# EAGLE schematic stereo_mix_back (EAGLE 9.4.2)

## Sheet 1 of 3: Channels
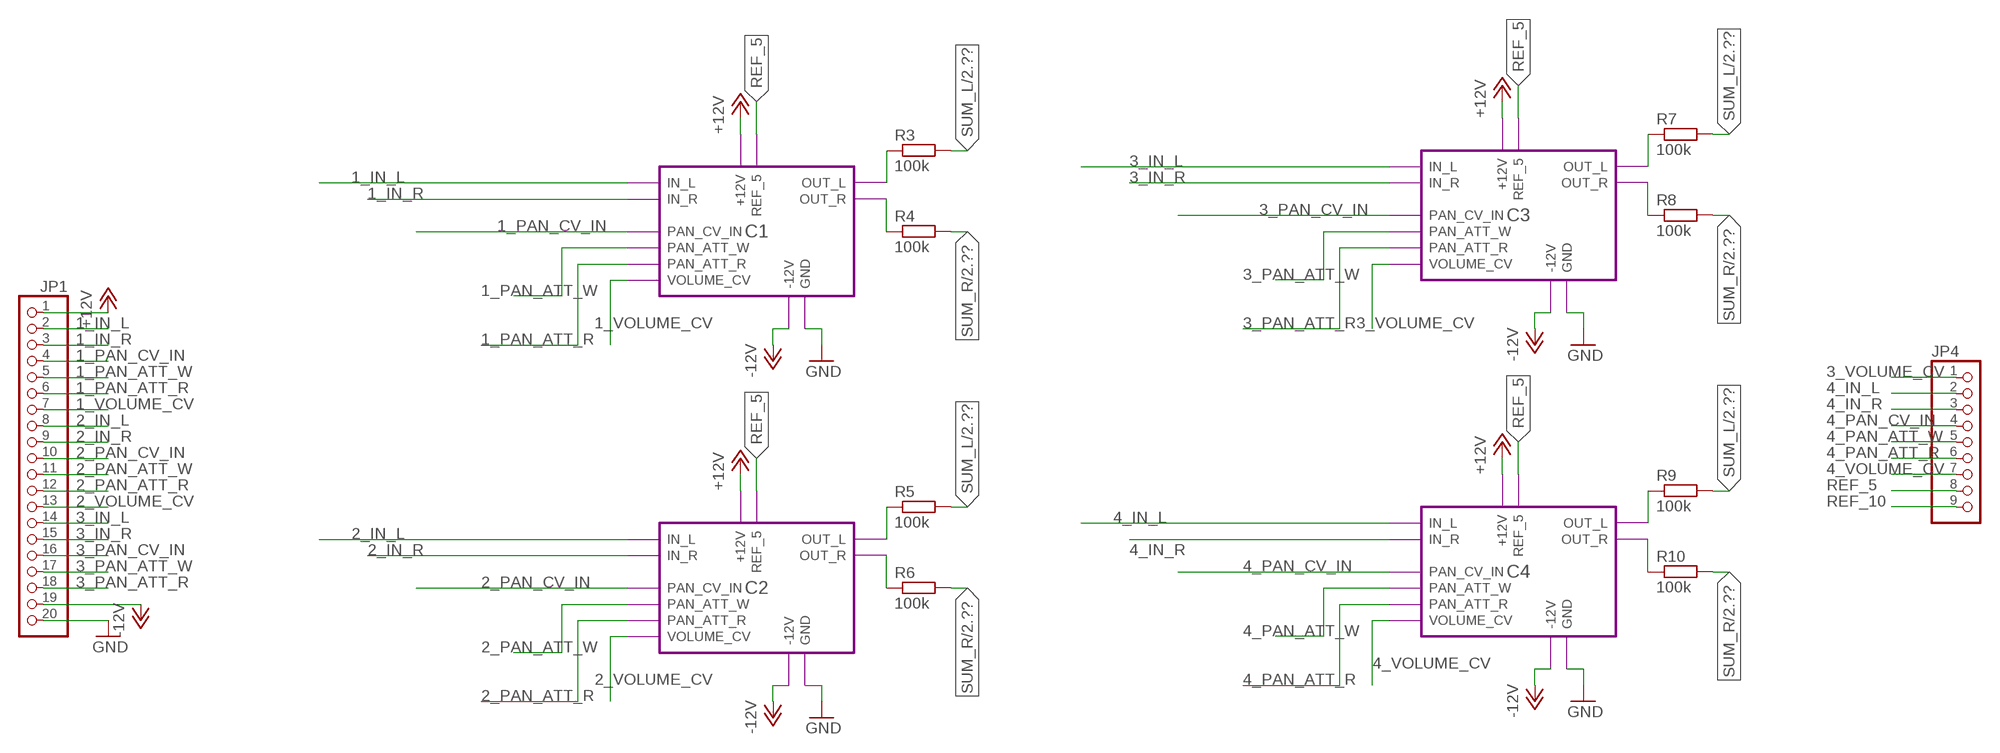
[diagram p0: schematic, sheet 1]

### Parts
JP1  PINHD-1X20  [1X20]
JP4  PINHD-1X9  [1X09]
R3  100k  R-EU_R0603  [R0603]
R4  100k  R-EU_R0603  [R0603]
R5  100k  R-EU_R0603  [R0603]
R6  100k  R-EU_R0603  [R0603]
R7  100k  R-EU_R0603  [R0603]
R8  100k  R-EU_R0603  [R0603]
R9  100k  R-EU_R0603  [R0603]
R10  100k  R-EU_R0603  [R0603]

### Module instances
C2 = CHANNEL
C3 = CHANNEL
C4 = CHANNEL
C1 = CHANNEL

### Nets
1_IN_L: JP1.2 ; port C1.IN_L
1_IN_R: JP1.3 ; port C1.IN_R
1_PAN_ATT_R: JP1.6 ; port C1.PAN_ATT_R
1_PAN_ATT_W: JP1.5 ; port C1.PAN_ATT_W
1_PAN_CV_IN: JP1.4 ; port C1.PAN_CV_IN
1_VOLUME_CV: JP1.7 ; port C1.VOLUME_CV
2_IN_L: JP1.8 ; port C2.IN_L
2_IN_R: JP1.9 ; port C2.IN_R
2_PAN_ATT_R: JP1.12 ; port C2.PAN_ATT_R
2_PAN_ATT_W: JP1.11 ; port C2.PAN_ATT_W
2_PAN_CV_IN: JP1.10 ; port C2.PAN_CV_IN
2_VOLUME_CV: JP1.13 ; port C2.VOLUME_CV
3_IN_L: JP1.14 ; port C3.IN_L
3_IN_R: JP1.15 ; port C3.IN_R
3_PAN_ATT_R: JP1.18 ; port C3.PAN_ATT_R
3_PAN_ATT_W: JP1.17 ; port C3.PAN_ATT_W
3_PAN_CV_IN: JP1.16 ; port C3.PAN_CV_IN
3_VOLUME_CV: JP4.1 ; port C3.VOLUME_CV
4_IN_L: JP4.2 ; port C4.IN_L
4_IN_R: JP4.3 ; port C4.IN_R
4_PAN_ATT_R: JP4.6 ; port C4.PAN_ATT_R
4_PAN_ATT_W: JP4.5 ; port C4.PAN_ATT_W
4_PAN_CV_IN: JP4.4 ; port C4.PAN_CV_IN
4_VOLUME_CV: JP4.7 ; port C4.VOLUME_CV
+12V: JP1.1 ; port C2.+12V C3.+12V C4.+12V C1.+12V ; also sheet 2,3
-12V: JP1.19 ; port C2.-12V C3.-12V C4.-12V C1.-12V ; also sheet 2,3
GND: JP1.20 ; port C2.GND C3.GND C4.GND C1.GND ; also sheet 2,3
N$29: R3.1 ; port C1.OUT_L
N$30: R4.1 ; port C1.OUT_R
N$33: R5.1 ; port C2.OUT_L
N$35: R6.1 ; port C2.OUT_R
N$37: R7.1 ; port C3.OUT_L
N$38: R8.1 ; port C3.OUT_R
N$39: R9.1 ; port C4.OUT_L
N$40: R10.1 ; port C4.OUT_R
REF_5: JP4.8 ; also sheet 3
REF_10: JP4.9 ; also sheet 3
SUM_L: R3.2 R5.2 R7.2 R9.2 ; also sheet 2
SUM_R: R4.2 R6.2 R8.2 R10.2 ; also sheet 2

## Sheet 2 of 3: Output
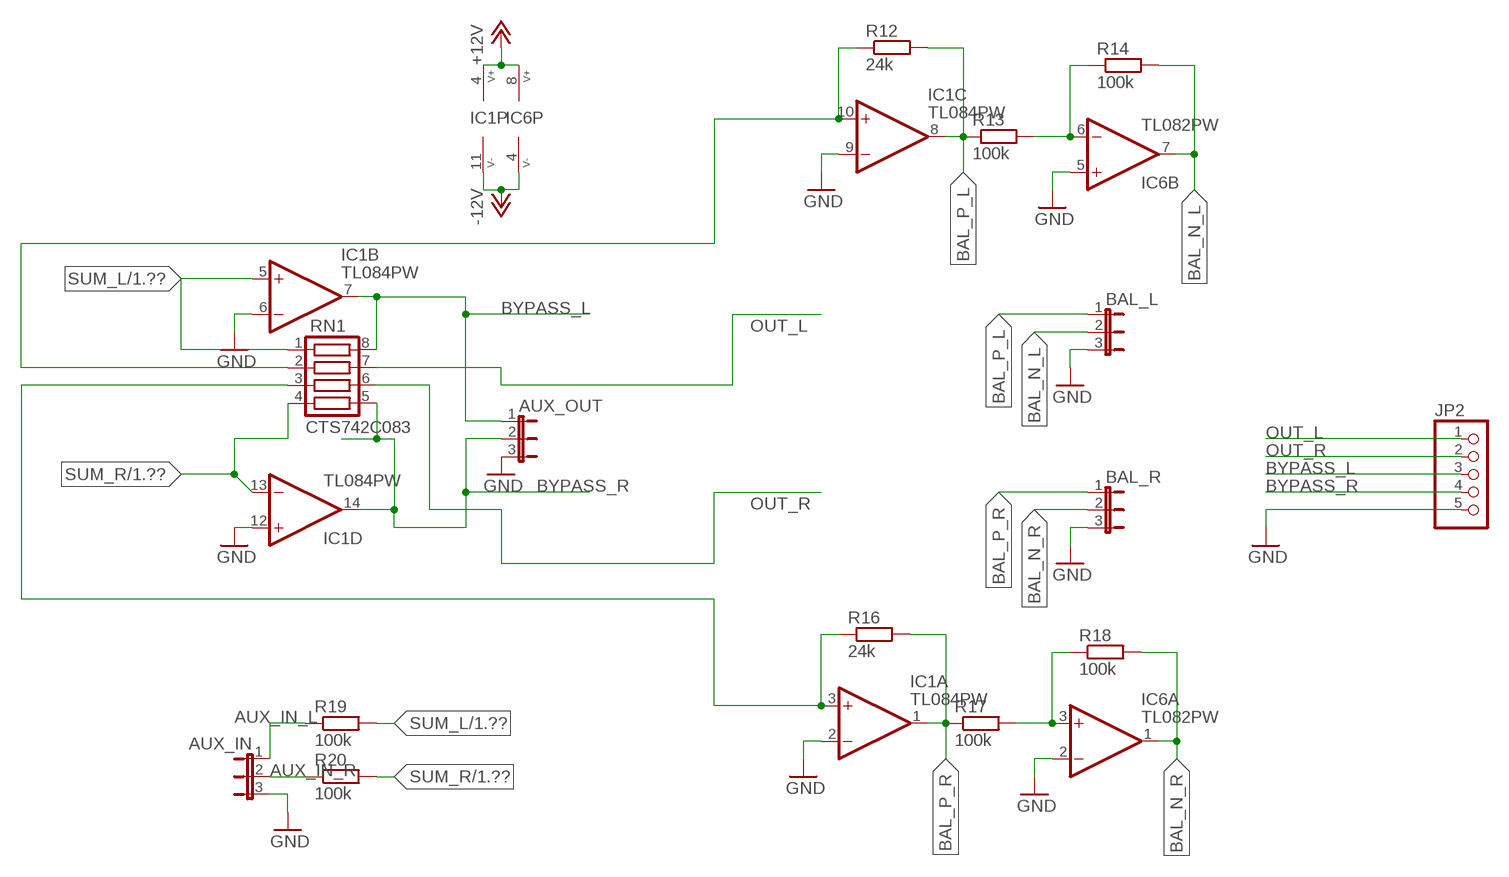
[diagram p1: schematic, sheet 2]

### Parts
AUX_IN  JP2E  [JP2]
AUX_OUT  JP2E  [JP2]
BAL_L  JP2E  [JP2]
BAL_R  JP2E  [JP2]
IC1  TL084PW  [TSSOP14]
IC6  TL082PW  [TSSOP8]
JP2  PINHD-1X5  [1X05]
R12  24k  R-EU_R0603  [R0603]
R13  100k  R-EU_R0603  [R0603]
R14  100k  R-EU_R0603  [R0603]
R16  24k  R-EU_R0603  [R0603]
R17  100k  R-EU_R0603  [R0603]
R18  100k  R-EU_R0603  [R0603]
R19  100k  R-EU_R0603  [R0603]
R20  100k  R-EU_R0603  [R0603]
RN1  CTS742C083  [CTS742C083]

### Nets
+12V: IC1.4(P:V+) IC6.8(P:V+) ; also sheet 1,3
-12V: IC1.11(P:V-) IC6.4(P:V-) ; also sheet 1,3
AUX_IN_L: AUX_IN.1 R19.1
AUX_IN_R: AUX_IN.2 R20.1
BAL_N_L: BAL_L.2 IC6.7(B:OUT) R14.2
BAL_N_R: BAL_R.2 IC6.1(A:OUT) R18.2
BAL_P_L: BAL_L.1 IC1.8(C:OUT) R12.2 R13.1
BAL_P_R: BAL_R.1 IC1.1(A:OUT) R16.2 R17.1
BYPASS_L: AUX_OUT.1 IC1.7(B:OUT) JP2.3 RN1.8
BYPASS_R: AUX_OUT.2 IC1.14(D:OUT) JP2.4 RN1.5
GND: AUX_IN.3 AUX_OUT.3 BAL_L.3 BAL_R.3 IC1.2(A:-IN) IC1.6(B:-IN) IC1.9(C:-IN) IC1.12(D:+IN) IC6.2(A:-IN) IC6.5(B:+IN) JP2.5 ; also sheet 1,3
N$32: IC1.10(C:+IN) R12.1 RN1.2
N$42: IC1.3(A:+IN) R16.1 RN1.3
N$43: IC6.3(A:+IN) R17.2 R18.1
N$45: IC6.6(B:-IN) R13.2 R14.1
OUT_L: JP2.1 RN1.7
OUT_R: JP2.2 RN1.6
SUM_L: IC1.5(B:+IN) R19.2 RN1.1 ; also sheet 1
SUM_R: IC1.13(D:-IN) R20.2 RN1.4 ; also sheet 1

## Sheet 3 of 3: Power
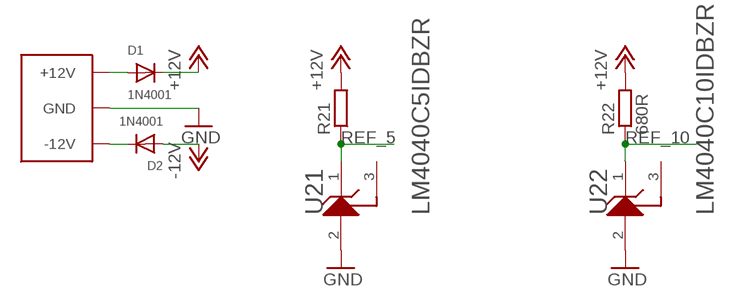
[diagram p2: schematic, sheet 3]

### Parts
C5  EURO_POWER_LOCKFAT-LOCK  [EURO_PWR_HEADER_LOCK]
D1  1N4001  DIODESMA  [SMADIODE]
D2  1N4001  DIODESMA  [SMADIODE]
R21  R-EU_R0603  [R0603]
R22  680R  R-EU_R0603  [R0603]
U21  TEXAS_INSTRUMENTS_LM4040C5IDBZR  [TEXAS_INSTRUMENTS_LM4040C5IDBZR_0]
U22  TEXAS_INSTRUMENTS_LM4040C10IDBZR  [TEXAS_INSTRUMENTS_LM4040C5IDBZR_0]

### Nets
+12V: D1.C R21.2 R22.2 ; also sheet 1,2
-12V: D2.A ; also sheet 1,2
GND: C5.GND1(GND) C5.GND2(GND) C5.GND3(GND) C5.GND4(GND) C5.GND5(GND) C5.GND6(GND) U21.2(ANODE) U22.2(ANODE) ; also sheet 1,2
N$47: C5.POS1(+12V) C5.POS2(+12V) D1.A
N$48: C5.NEG1(-12V) C5.NEG2(-12V) D2.C
REF_5: R21.1 U21.1(CATHODE) ; also sheet 1
REF_10: R22.1 U22.1(CATHODE) ; also sheet 1
Unconnected: U21.3(NC) U22.3(NC)

## Library data of the parts
AUX_IN AUX_OUT BAL_L BAL_R = jumper:JP2E: JUMPER
C5 = MusicThingModular:EURO_POWER_LOCK
D1 D2 = adafruit:DIODE: Diode SMADIODE - SMA Surface Mount Package 20V 1A Schottky Diode Digikey: 641-1014-6-ND DO-1N4148 - Through Hole Small Current Diode SOD-123 20V 1 A (.5mV Vf) Schottky Diode - Digikey: MBRX120TPMSCT-ND SOD-323 10V 570mA (.38mV Vf, 3ns) Schottky Diode - Digikey: ZLLS410CT-ND SOD-523 30V 30mA Schottky Diode (RB751S-40TE61) - Digikey: RB751S-40TE61CT-ND SOT23-R/W - SOT23 Package (R = Solder Paste/Reflow Ovens, W = Hand-Soldering) BAT54Film 40V 300mA - Digikey: 497-7162-1-ND
IC1 = op-amp:TL084: JFET OP-AMP - Quad
IC6 = op-amp:TL082: JFET OP-AMP - Dual
JP1 = pinhead:PINHD-1X20: PIN HEADER
JP2 = pinhead:PINHD-1X5: PIN HEADER
JP4 = pinhead:PINHD-1X9: PIN HEADER
R3-R10 R12-R14 R16-R22 = rcl:R-EU_: RESISTOR, European symbol; SPICEPREFIX: R
RN1 = resistor-net:CTS742C083: Chip Resistor Array 4 Single Resistor Source: http://www.ctscorp.com/components/Datasheets/CTSChipArrayDs.pdf; OC_FARNELL: unknown; OC_NEWARK: unknown
U21 = lm4040:TEXAS_INSTRUMENTS_LM4040C5IDBZR: TI-LM4040C25DBZ3
U22 = lm4040:TEXAS_INSTRUMENTS_LM4040C10IDBZR: TI-LM4040C25DBZ3

## Module CHANNEL
Ports: IN_L(in) IN_R(in) PAN_CV_IN(in) PAN_ATT_W(in) PAN_ATT_R(in) VOLUME_CV(in) -12V(pwr) GND(pwr) +12V(pwr) REF_5(pwr) OUT_L(out) OUT_R(out)
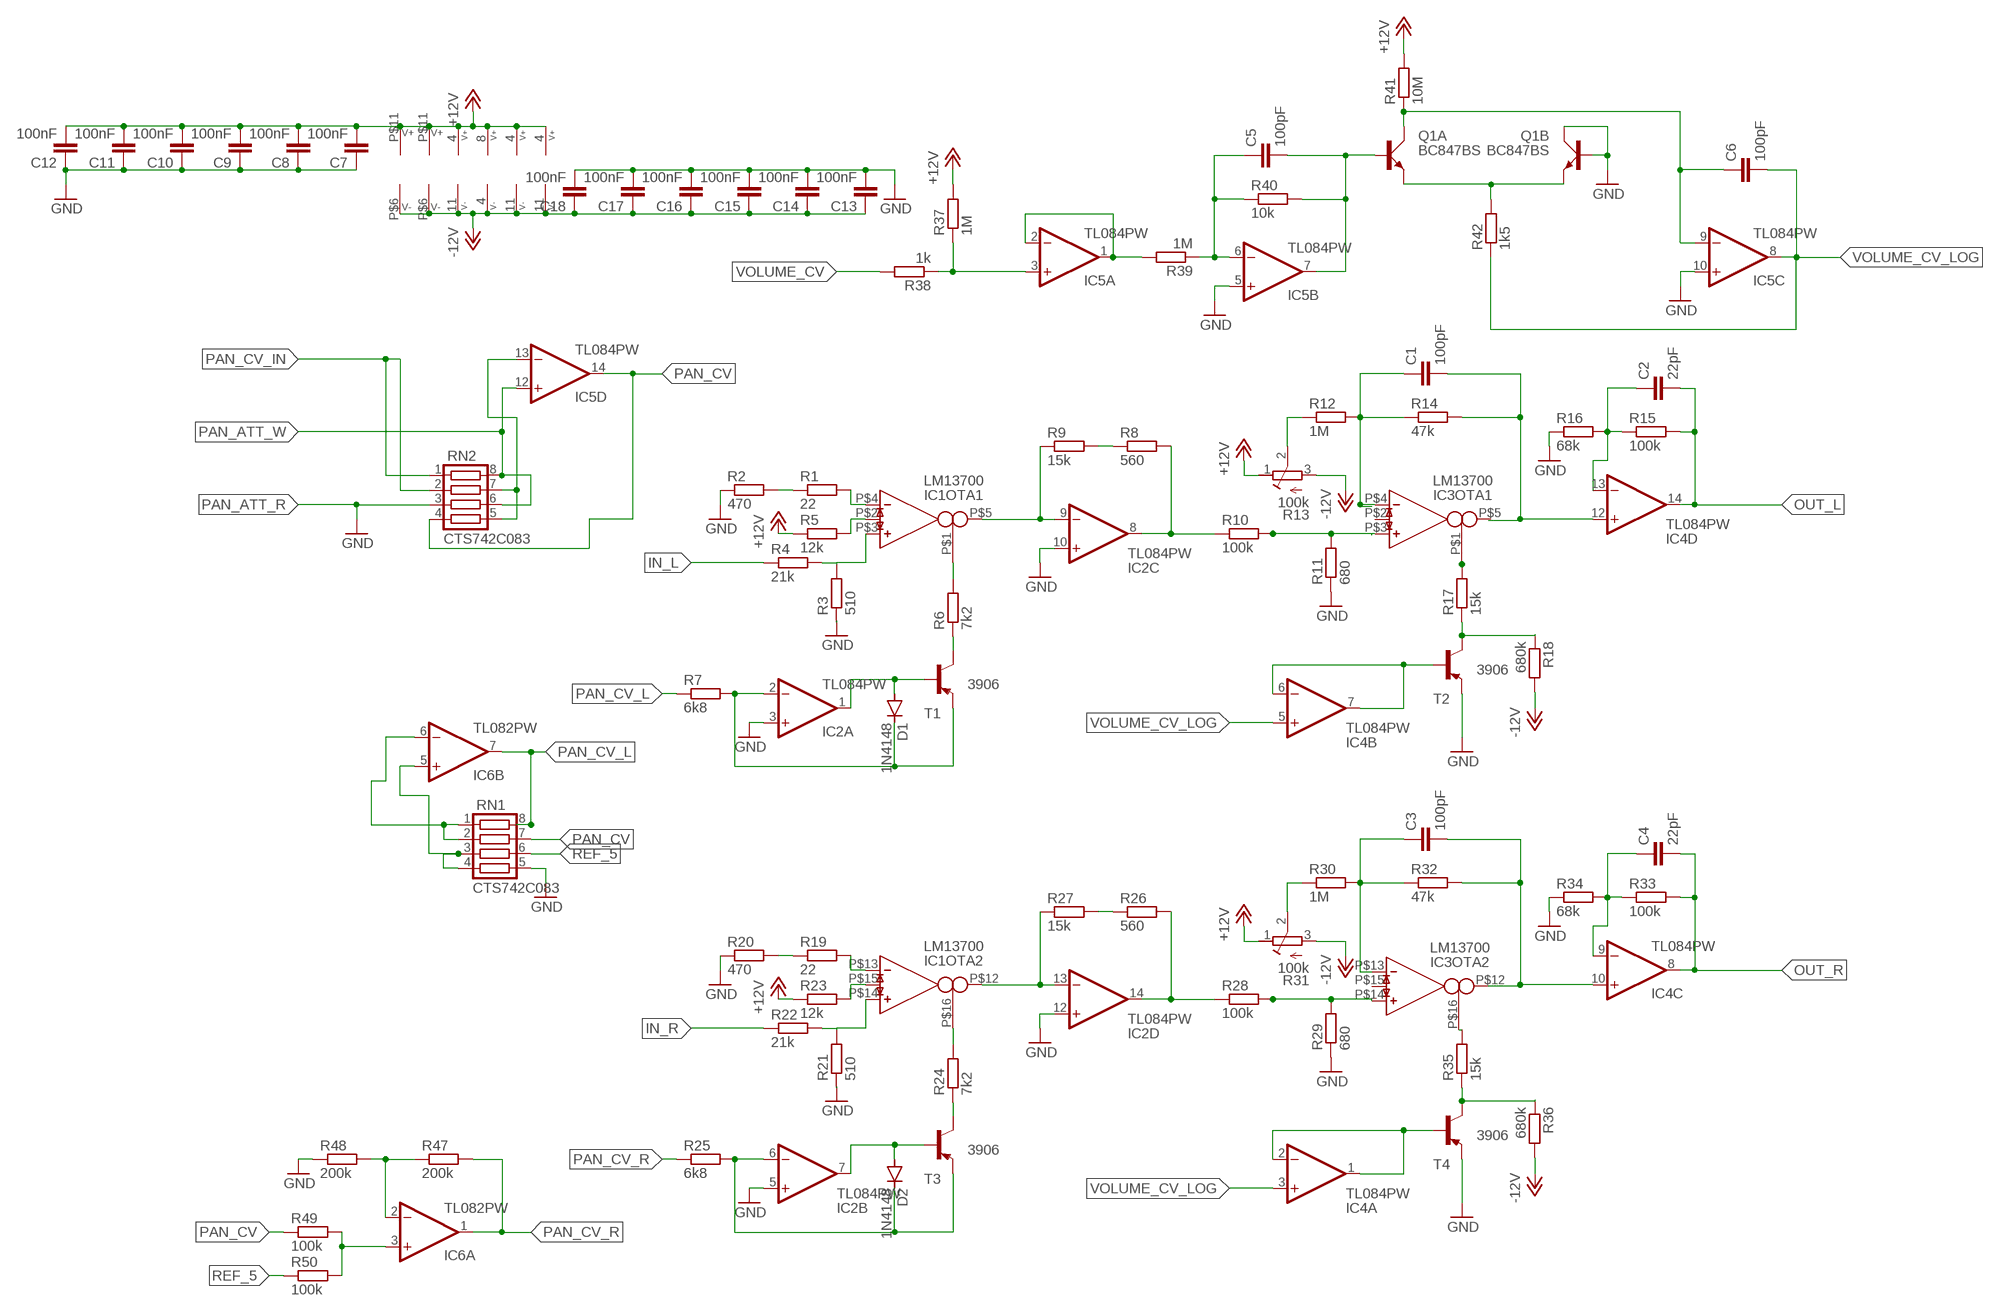
[diagram p3: schematic, module CHANNEL, sheet 1]

### Parts
C1  100pF  C-EUC0603  [C0603]
C2  22pF  C-EUC0603  [C0603]
C3  100pF  C-EUC0603  [C0603]
C4  22pF  C-EUC0603  [C0603]
C5  100pF  C-EUC0603  [C0603]
C6  100pF  C-EUC0603  [C0603]
C7  100nF  C-EUC0603  [C0603]
C8  100nF  C-EUC0603  [C0603]
C9  100nF  C-EUC0603  [C0603]
C10  100nF  C-EUC0603  [C0603]
C11  100nF  C-EUC0603  [C0603]
C12  100nF  C-EUC0603  [C0603]
C13  100nF  C-EUC0603  [C0603]
C14  100nF  C-EUC0603  [C0603]
C15  100nF  C-EUC0603  [C0603]
C16  100nF  C-EUC0603  [C0603]
C17  100nF  C-EUC0603  [C0603]
C18  100nF  C-EUC0603  [C0603]
D1  1N4148  DIODE-SOD323-W  [SOD323-W]
D2  1N4148  DIODE-SOD323-W  [SOD323-W]
IC1  LM13700  [DMP16]
IC2  TL084PW  [TSSOP14]
IC3  LM13700  [DMP16]
IC4  TL084PW  [TSSOP14]
IC5  TL084PW  [TSSOP14]
IC6  TL082PW  [TSSOP8]
Q1  BC847BS  [SOT363_PHILIPS]
R1  22  R-EU_R0603  [R0603]
R2  470  R-EU_R0603  [R0603]
R3  510  R-EU_R0603  [R0603]
R4  21k  R-EU_R0603  [R0603]
R5  12k  R-EU_R0603  [R0603]
R6  7k2  R-EU_R0603  [R0603]
R7  6k8  R-EU_R0603  [R0603]
R8  560  R-EU_R0603  [R0603]
R9  15k  R-EU_R0603  [R0603]
R10  100k  R-EU_R0603  [R0603]
R11  680  R-EU_R0603  [R0603]
R12  1M  R-EU_R0603  [R0603]
R13  100k  R-TRIMMT93YA  [RTRIMT93YA]
R14  47k  R-EU_R0603  [R0603]
R15  100k  R-EU_R0603  [R0603]
R16  68k  R-EU_R0603  [R0603]
R17  15k  R-EU_R0603  [R0603]
R18  680k  R-EU_R0603  [R0603]
R19  22  R-EU_R0603  [R0603]
R20  470  R-EU_R0603  [R0603]
R21  510  R-EU_R0603  [R0603]
R22  21k  R-EU_R0603  [R0603]
R23  12k  R-EU_R0603  [R0603]
R24  7k2  R-EU_R0603  [R0603]
R25  6k8  R-EU_R0603  [R0603]
R26  560  R-EU_R0603  [R0603]
R27  15k  R-EU_R0603  [R0603]
R28  100k  R-EU_R0603  [R0603]
R29  680  R-EU_R0603  [R0603]
R30  1M  R-EU_R0603  [R0603]
R31  100k  R-TRIMMT93YA  [RTRIMT93YA]
R32  47k  R-EU_R0603  [R0603]
R33  100k  R-EU_R0603  [R0603]
R34  68k  R-EU_R0603  [R0603]
R35  15k  R-EU_R0603  [R0603]
R36  680k  R-EU_R0603  [R0603]
R37  1M  R-EU_R0603  [R0603]
R38  1k  R-EU_R0603  [R0603]
R39  1M  R-EU_R0603  [R0603]
R40  10k  R-EU_R0603  [R0603]
R41  10M  R-EU_R0603  [R0603]
R42  1k5  R-EU_R0603  [R0603]
R47  200k  R-EU_R0603  [R0603]
R48  200k  R-EU_R0603  [R0603]
R49  100k  R-EU_R0603  [R0603]
R50  100k  R-EU_R0603  [R0603]
RN1  CTS742C083  [CTS742C083]
RN2  CTS742C083  [CTS742C083]
T1  3906  MMBT3906LT1-PNP-SOT23-BEC  [SOT23-BEC]
T2  3906  MMBT3906LT1-PNP-SOT23-BEC  [SOT23-BEC]
T3  3906  MMBT3906LT1-PNP-SOT23-BEC  [SOT23-BEC]
T4  3906  MMBT3906LT1-PNP-SOT23-BEC  [SOT23-BEC]

### Nets
+12V: C7.2 C8.2 C9.2 C10.2 C11.2 C12.2 IC1.P$11(SUPPLY:V+) IC2.4(P:V+) IC3.P$11(SUPPLY:V+) IC4.4(P:V+) IC5.4(P:V+) IC6.8(P:V+) R5.1 R13.1(E) R23.1 R31.1(E) R37.2 R41.2
-12V: C13.1 C14.1 C15.1 C16.1 C17.1 C18.1 IC1.P$6(SUPPLY:V-) IC2.11(P:V-) IC3.P$6(SUPPLY:V-) IC4.11(P:V-) IC5.11(P:V-) IC6.4(P:V-) R13.3(A) R18.2 R31.3(A) R36.2
GND: C7.1 C8.1 C9.1 C10.1 C11.1 C12.1 C13.2 C14.2 C15.2 C16.2 C17.2 C18.2 IC2.3(A:+IN) IC2.5(B:+IN) IC2.10(C:+IN) IC2.12(D:+IN) IC5.5(B:+IN) IC5.10(C:+IN) Q1.3(B:C) Q1.5(B:B) R2.1 R3.1 R11.1 R16.1 R20.1 R21.1 R29.1 R34.1 R48.1 RN1.5 T2.E T4.E
IN_L: R4.1
IN_R: R22.1
N$1: IC1.P$4(OTA1:IN_N) R1.2
N$2: R1.1 R2.2
N$3: IC1.P$3(OTA1:IN_P) R3.2 R4.2
N$4: IC1.P$1(OTA1:I_BIAS) R6.2
N$5: IC1.P$2(OTA1:I_DIODE) R5.2
N$6: R6.1 T1.C
N$7: D1.A IC2.1(A:OUT) T1.B
N$8: D1.C IC2.2(A:-IN) R7.2 T1.E
N$9: IC1.P$5(OTA1:OUT) IC2.9(C:-IN) R9.1
N$10: R8.1 R9.2
N$11: IC2.8(C:OUT) R8.2 R10.1
N$12: C1.1 IC3.P$4(OTA1:IN_N) R12.2 R14.1
N$13: IC3.P$3(OTA1:IN_P) R10.2 R11.2
N$14: R12.1 R13.2(S)
N$15: C2.1 IC4.13(D:-IN) R15.1 R16.2
N$16: C1.2 IC4.12(D:+IN) R14.2
N$17: IC3.P$1(OTA1:I_BIAS) R17.2
N$18: R17.1 R18.1 T2.C
N$19: IC4.6(B:-IN) IC4.7(B:OUT) T2.B
N$20: IC1.P$13(OTA2:IN_N) R19.2
N$21: R19.1 R20.2
N$22: IC1.P$14(OTA2:IN_P) R21.2 R22.2
N$23: IC1.P$15(OTA2:I_DIODE) R23.2
N$24: IC1.P$16(OTA2:I_BIAS) R24.2
N$25: R24.1 T3.C
N$26: D2.A IC2.7(B:OUT) T3.B
N$27: D2.C IC2.6(B:-IN) R25.2 T3.E
N$28: IC1.P$12(OTA2:OUT) IC2.13(D:-IN) R27.1
N$29: R26.1 R27.2
N$30: IC2.14(D:OUT) R26.2 R28.1
N$31: IC3.P$14(OTA2:IN_P) R28.2 R29.2
N$32: C3.1 IC3.P$13(OTA2:IN_N) R30.2 R32.1
N$33: R30.1 R31.2(S)
N$34: C3.2 IC3.P$12(OTA2:OUT) IC4.10(C:+IN) R32.2
N$35: C4.1 IC4.9(C:-IN) R33.1 R34.2
N$36: IC3.P$16(OTA2:I_BIAS) R35.2
N$37: R35.1 R36.1 T4.C
N$38: IC4.1(A:OUT) IC4.2(A:-IN) T4.B
N$39: IC5.1(A:OUT) IC5.2(A:-IN) R39.2
N$40: IC5.3(A:+IN) R37.1 R38.1
N$41: C5.1 IC5.6(B:-IN) R39.1 R40.1
N$42: C5.2 IC5.7(B:OUT) Q1.2(A:B) R40.2
N$43: IC6.5(B:+IN) RN1.3 RN1.4
N$44: C6.1 IC5.9(C:-IN) Q1.6(A:C) R41.1
N$45: IC6.6(B:-IN) RN1.1 RN1.2
N$46: Q1.1(A:E) Q1.4(B:E) R42.2
N$47: IC6.2(A:-IN) R47.1 R48.2
N$48: IC5.13(D:-IN) RN2.5 RN2.7
N$50: IC6.3(A:+IN) R49.2 R50.2
OUT_L: C2.2 IC4.14(D:OUT) R15.2
OUT_R: C4.2 IC4.8(C:OUT) R33.2
PAN_ATT_R: RN2.3 ; supply symbol labelled GND
PAN_ATT_W: IC5.12(D:+IN) RN2.6 RN2.8
PAN_CV: IC5.14(D:OUT) R49.1 RN1.7 RN2.4
PAN_CV_IN: RN2.1 RN2.2
PAN_CV_L: IC6.7(B:OUT) R7.1 RN1.8
PAN_CV_R: IC6.1(A:OUT) R25.1 R47.2
REF_5: R50.1 RN1.6
VOLUME_CV: R38.2
VOLUME_CV_LOG: C6.2 IC4.3(A:+IN) IC4.5(B:+IN) IC5.8(C:OUT) R42.1
Unconnected: IC1.P$7(BUF1:B) IC1.P$8(BUF1:E) IC1.P$9(BUF2:E) IC1.P$10(BUF2:B) IC3.P$2(OTA1:I_DIODE) IC3.P$5(OTA1:OUT) IC3.P$7(BUF1:B) IC3.P$8(BUF1:E) IC3.P$9(BUF2:E) IC3.P$10(BUF2:B) IC3.P$15(OTA2:I_DIODE)

### Library data of the parts
C1-C18 = rcl:C-EU: CAPACITOR, European symbol; SPICEPREFIX: C
D1 D2 = diode:DIODE-: DIODE
IC1 IC3 = ota:LM13700: Dual OTA with buffers
IC2 IC4 IC5 = op-amp:TL084: JFET OP-AMP - Quad
IC6 = op-amp:TL082: JFET OP-AMP - Dual
Q1 = transistor-small-signal:BC847BS: NPN general purpose double transistor Source: http://www.farnell.com/datasheets/2466.pdf
R1-R12 R14-R30 R32-R42 R47-R50 = rcl:R-EU_: RESISTOR, European symbol; SPICEPREFIX: R
R13 R31 = rcl:R-TRIMM: Trimm resistor; SPICEMODEL: X; SPICEPREFIXL: POT
RN1 RN2 = resistor-net:CTS742C083: Chip Resistor Array 4 Single Resistor Source: http://www.ctscorp.com/components/Datasheets/CTSChipArrayDs.pdf; OC_FARNELL: unknown; OC_NEWARK: unknown
T1-T4 = transistor-neu-to92:*-PNP-: PNP Transistror